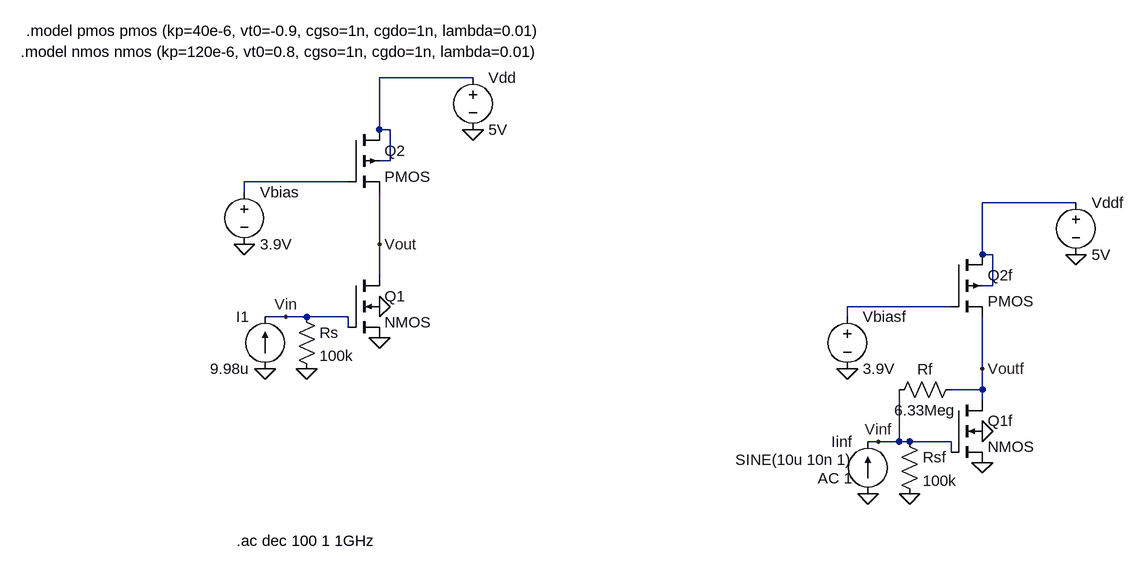
[diagram p0: schematic Draft1.asc]
Draft1.asc, the LTspice schematic file:
Version 4
SHEET 1 1956 680
WIRE 272 -256 128 -256
WIRE 128 -176 128 -256
WIRE 144 -176 128 -176
WIRE 144 -128 144 -176
WIRE 144 -128 128 -128
WIRE 80 -96 -80 -96
WIRE -80 -80 -80 -96
WIRE 1200 -64 1056 -64
WIRE 128 0 128 -80
WIRE 1056 16 1056 -64
WIRE 1072 16 1056 16
WIRE 128 48 128 0
WIRE 1072 64 1072 16
WIRE 1072 64 1056 64
WIRE 1008 96 848 96
WIRE -16 112 -48 112
WIRE 16 112 -16 112
WIRE 80 112 16 112
WIRE 848 112 848 96
WIRE 80 128 80 112
WIRE 1056 192 1056 112
WIRE 1056 224 1056 192
WIRE 1056 224 1008 224
WIRE 1056 240 1056 224
WIRE 896 304 880 304
WIRE 928 304 928 224
WIRE 928 304 896 304
WIRE 944 304 928 304
WIRE 1008 304 944 304
WIRE 1008 320 1008 304
FLAG 128 144 0
FLAG 128 96 0
FLAG 272 -176 0
FLAG -80 0 0
FLAG -48 192 0
FLAG 16 192 0
FLAG 128 0 Vout
FLAG -16 112 Vin
FLAG 1056 336 0
FLAG 1056 288 0
FLAG 1200 16 0
FLAG 848 192 0
FLAG 880 384 0
FLAG 944 384 0
FLAG 1056 192 Voutf
FLAG 896 304 Vinf
SYMBOL nmos4 80 48 R0
SYMATTR InstName Q1
SYMATTR Value2 l=1u w=3.25u
SYMBOL pmos4 80 -176 R0
SYMATTR InstName Q2
SYMATTR Value2 l=1u w=10u
SYMBOL voltage 272 -272 R0
WINDOW 123 0 0 Left 0
WINDOW 39 0 0 Left 0
SYMATTR InstName Vdd
SYMATTR Value 5V
SYMBOL voltage -80 -96 R0
WINDOW 123 0 0 Left 0
WINDOW 39 0 0 Left 0
SYMATTR InstName Vbias
SYMATTR Value 3.9V
SYMBOL res 0 96 R0
SYMATTR InstName Rs
SYMATTR Value 100k
SYMBOL nmos4 1008 240 R0
SYMATTR InstName Q1f
SYMATTR Value2 l=1u w=3.25u
SYMBOL pmos4 1008 16 R0
SYMATTR InstName Q2f
SYMATTR Value2 l=1u w=10u
SYMBOL voltage 1200 -80 R0
WINDOW 123 0 0 Left 0
WINDOW 39 0 0 Left 0
SYMATTR InstName Vddf
SYMATTR Value 5V
SYMBOL voltage 848 96 R0
WINDOW 123 0 0 Left 0
WINDOW 39 0 0 Left 0
SYMATTR InstName Vbiasf
SYMATTR Value 3.9V
SYMBOL current 880 384 R180
WINDOW 0 24 80 Left 2
WINDOW 3 24 52 Left 2
WINDOW 123 24 24 Left 2
WINDOW 39 0 0 Left 0
SYMATTR InstName Iinf
SYMATTR Value SINE(10u 10n 1)
SYMATTR Value2 AC 1
SYMBOL res 928 288 R0
SYMATTR InstName Rsf
SYMATTR Value 100k
SYMBOL res 1024 208 R90
WINDOW 0 0 56 VBottom 2
WINDOW 3 32 56 VTop 2
SYMATTR InstName Rf
SYMATTR Value 6.33Meg
SYMBOL current -48 192 R180
WINDOW 0 24 80 Left 2
WINDOW 3 24 0 Left 2
WINDOW 123 0 0 Left 0
WINDOW 39 0 0 Left 0
SYMATTR InstName I1
SYMATTR Value 9.98u
TEXT -416 -328 Left 2 !.model pmos pmos (kp=40e-6, vt0=-0.9, cgso=1n, cgdo=1n, lambda=0.01)
TEXT -92 456 Left 2 !.ac dec 100 1 1GHz
TEXT -424 -296 Left 2 !.model nmos nmos (kp=120e-6, vt0=0.8, cgso=1n, cgdo=1n, lambda=0.01)

The netlist it stands for:
* Draft1.asc
M§Q1 Vout Vin 0 0 NMOS l=1u w=3.25u
M§Q2 N001 N002 Vout N001 PMOS l=1u w=10u
Vdd N001 0 5V
Vbias N002 0 3.9V
Rs Vin 0 100k
M§Q1f Voutf Vinf 0 0 NMOS l=1u w=3.25u
M§Q2f N003 N004 Voutf N003 PMOS l=1u w=10u
Vddf N003 0 5V
Vbiasf N004 0 3.9V
Iinf 0 Vinf SINE(10u 10n 1) AC 1
Rsf Vinf 0 100k
Rf Voutf Vinf 6.33Meg
I1 0 Vin 9.98u
.model NMOS NMOS
.model PMOS PMOS
.lib standard.mos
.model pmos pmos (kp=40e-6, vt0=-0.9, cgso=1n, cgdo=1n, lambda=0.01)
.ac dec 100 1 1GHz
.model nmos nmos (kp=120e-6, vt0=0.8, cgso=1n, cgdo=1n, lambda=0.01)
.backanno
.end